# EAGLE design Mainboard (EAGLE 9.2.2)
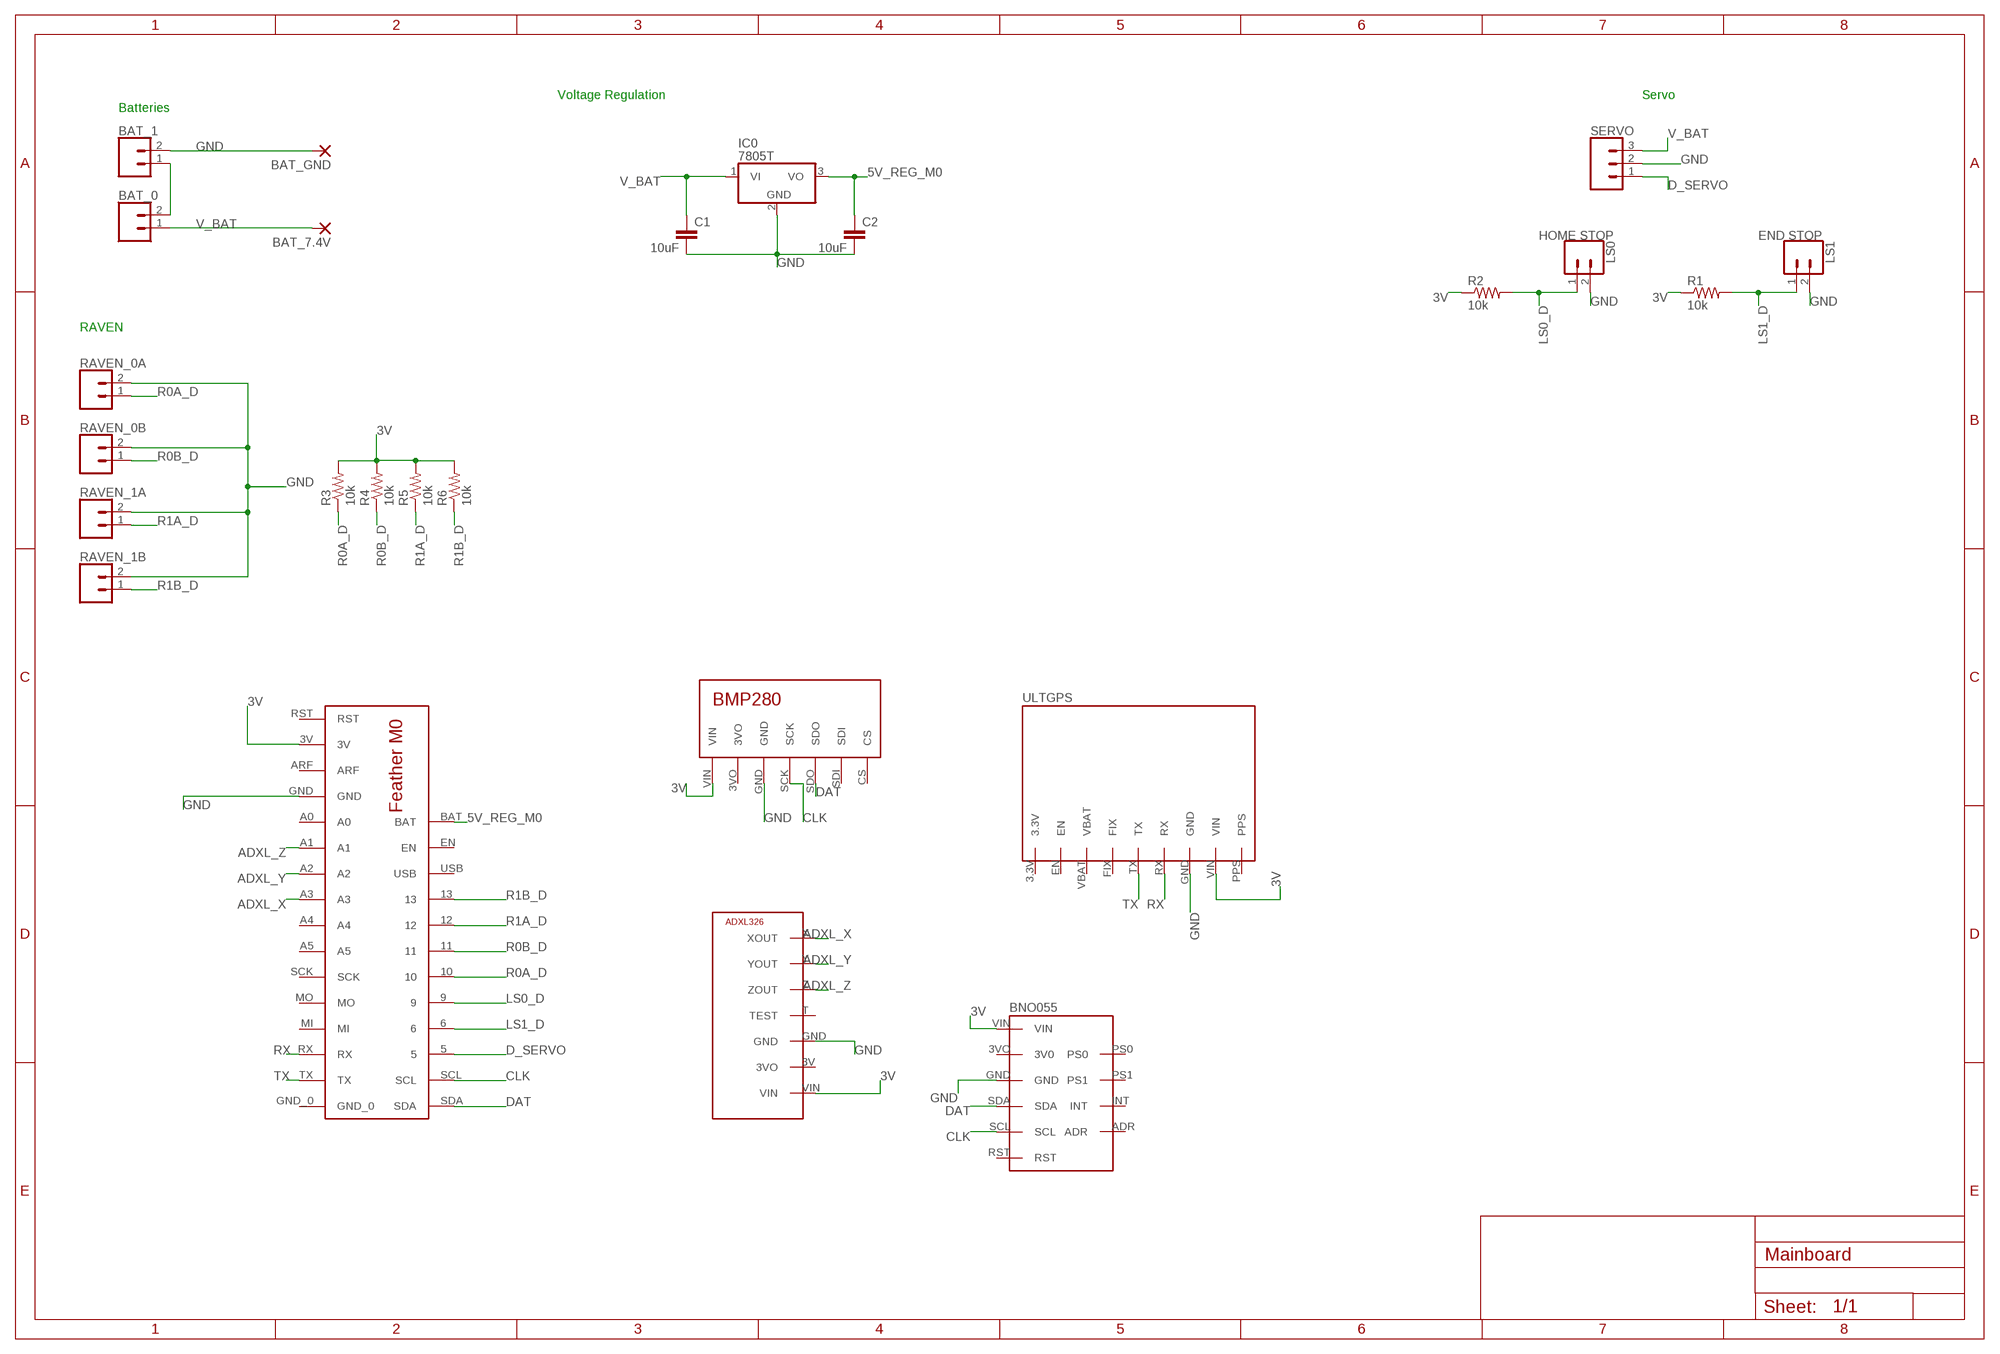
[diagram p0: schematic, sheet 1]

## Parts
BAT_0  CONN_02JST-PTH-2  [JST-2-PTH]
BAT_1  CONN_02JST-PTH-2  [JST-2-PTH]
BAT_7.4V  3,81/1,4  [3,81/1,4]
BAT_GND  3,81/1,4  [3,81/1,4]
C1  10uF  C2,5-3  [C2.5-3]
C2  10uF  C2,5-3  [C2.5-3]
IC0  7805T  [TO220H]
LS0  HOME STOP  CONN_02JST-PTH-2  [JST-2-PTH]
LS1  END STOP  CONN_02JST-PTH-2  [JST-2-PTH]
R1  10k  R-US_0207/10  [0207/10]
R2  10k  R-US_0207/10  [0207/10]
R3  10k  R-US_0207/10  [0207/10]
R4  10k  R-US_0207/10  [0207/10]
R5  10k  R-US_0207/10  [0207/10]
R6  10k  R-US_0207/10  [0207/10]
RAVEN_0A  CONN_02JST-PTH-2  [JST-2-PTH]
RAVEN_0B  CONN_02JST-PTH-2  [JST-2-PTH]
RAVEN_1A  CONN_02JST-PTH-2  [JST-2-PTH]
RAVEN_1B  CONN_02JST-PTH-2  [JST-2-PTH]
SERVO  CONN_03JST-PTH  [JST-3-PTH]
U$1  M0  [M0]
U$2  BMP  [BMP]
U$3  ADXL377  [ADXL377]
U$4  ULTGPS  [ULTGPS]
U$5  BNO055  [BNO055]

## Nets
3V: R1.1 R2.1 R3.2 R4.2 R5.2 R6.2 U$1.3V U$2.VIN U$3.VIN U$4.VIN U$5.VIN
5V_REG_M0: C2.1 IC0.3(VO) U$1.BAT
ADXL_X: U$1.A3 U$3.X(XOUT)
ADXL_Y: U$1.A2 U$3.Y(YOUT)
ADXL_Z: U$1.A1 U$3.Z(ZOUT)
B_INT: BAT_0.2 BAT_1.1
CLK: U$1.SCL U$2.SCK U$5.SCL
D_SERVO: SERVO.1 U$1.5
DAT: U$1.SDA U$2.SDO U$5.SDA
GND: BAT_1.2 BAT_GND.1(P) C1.2 C2.2 IC0.2(GND) LS0.2 LS1.2 RAVEN_0A.2 RAVEN_0B.2 RAVEN_1A.2 RAVEN_1B.2 SERVO.2 U$1.GND U$2.GND U$3.GND U$4.GND U$5.GND
LS0_D: LS0.1 R2.2 U$1.9
LS1_D: LS1.1 R1.2 U$1.6
R0A_D: R3.1 RAVEN_0A.1 U$1.10
R0B_D: R4.1 RAVEN_0B.1 U$1.11
R1A_D: R5.1 RAVEN_1A.1 U$1.12
R1B_D: R6.1 RAVEN_1B.1 U$1.13
RX: U$1.RX U$4.RX
TX: U$1.TX U$4.TX
V_BAT: BAT_0.1 BAT_7.4V.1(P) C1.1 IC0.1(VI) SERVO.3
Unconnected: U$1.A0 U$1.A4 U$1.A5 U$1.ARF U$1.EN U$1.GND_0 U$1.MI U$1.MO U$1.RST U$1.SCK U$1.USB U$2.3VO U$2.CS U$2.SDI U$3.3V(3VO) U$3.T(TEST) U$4.3.3V U$4.EN U$4.FIX U$4.PPS U$4.VBAT U$5.3VO(3V0) U$5.ADR U$5.INT U$5.PS0 U$5.PS1 U$5.RST

## Notes on the sheet
- Voltage Regulation | Servo
- Batteries
- RAVEN

## Library data of the parts
BAT_0 BAT_1 LS0 LS1 RAVEN_0A RAVEN_0B RAVEN_1A RAVEN_1B = SparkFun-Connectors:CONN_02: Multi connection point. Often used as Generic Header-pin footprint for 0.1 inch spaced/style header connections On any of the 0.1 inch spaced packages, you can populate with these: Break Away Headers - Straight <https://www.sparkfun.com/products/116> (PRT-00116) Break Away Male Headers - Right Angle <https://www.sparkfun.com/products/553> (PRT-00553) Female Headers <https://www.sparkfun.com/products/115> (PRT-00115) Break Away Headers - Machine Pin <https://www.sparkfun.com/products/117> (PRT-00117) Break Away Female Headers - Swiss Machine Pin <https://www.sparkfun.com/products/743> (PRT-00743) For SCREWTERMINALS and SPRING TERMINALS visit here: Screw Terimnals on SparkFun.com <https://www.sparkfun.com/search/results?term=Screw+Terminals> (5mm/3.5mm/2.54mm spacing) This device is also useful as a general connection point to wire up your design to another part of your project. Our various solder wires solder well into these plated through hole pads. Hook-Up Wire - Assortment (Stranded, 22 AWG) <https://www.sparkfun.com/products/11375> (PRT-11375) Hook-Up Wire - Assortment (Solid Core, 22 AWG) <https://www.sparkfun.com/products/11367> (PRT-11367) View the entire wire category on our website here <https://www.sparkfun.com/categories/141> Special notes: Molex polarized connector foot print use with: PRT-08233 with associated crimp pins and housings. 2.54_SCREWTERM for use with PRT-10571. 3.5mm Screw Terminal footprints for PRT-08084 5mm Screw Terminal footprints for use with PRT-08432; PROD_ID: CONN-09863; SKU: PRT-09914
BAT_7.4V BAT_GND = wirepad:3,81/1,4: THROUGH-HOLE PAD
C1 C2 = capacitor-wima:C: CAPACITOR naming: grid - package width
IC0 = linear:78*: Positive VOLTAGE REGULATOR Source: http://cache.national.com/ds/LM/LM78L05.pdf http://www.fairchildsemi.com/ds/LM/LM7805.pdf
R1-R6 = rcl:R-US_: RESISTOR, American symbol; SPICEPREFIX: R
SERVO = SparkFun-Connectors:CONN_03: Multi connection point. Often used as Generic Header-pin footprint for 0.1 inch spaced/style header connections On any of the 0.1 inch spaced packages, you can populate with these: Break Away Headers - Straight <https://www.sparkfun.com/products/116> (PRT-00116) Break Away Male Headers - Right Angle <https://www.sparkfun.com/products/553> (PRT-00553) Female Headers <https://www.sparkfun.com/products/115> (PRT-00115) Break Away Headers - Machine Pin <https://www.sparkfun.com/products/117> (PRT-00117) Break Away Female Headers - Swiss Machine Pin <https://www.sparkfun.com/products/743> (PRT-00743) Stackable Header - 3 Pin (Female, 0.1") <https://www.sparkfun.com/products/13875> (PRT-13875) For SCREWTERMINALS and SPRING TERMINALS visit here: Screw Terimnals on SparkFun.com <https://www.sparkfun.com/search/results?term=Screw+Terminals> (5mm/3.5mm/2.54mm spacing) This device is also useful as a general connection point to wire up your design to another part of your project. Our various solder wires solder well into these plated through hole pads. Hook-Up Wire - Assortment (Stranded, 22 AWG) <https://www.sparkfun.com/products/11375> (PRT-11375) Hook-Up Wire - Assortment (Solid Core, 22 AWG) <https://www.sparkfun.com/products/11367> (PRT-11367) View the entire wire category on our website here <https://www.sparkfun.com/categories/141> Special notes: Molex polarized connector foot print use with SKU : PRT-08232 with associated crimp pins and housings.; PROD_ID: WIRE-10037; SF_ID: PRT-09915
U$1 = M0:M0
U$2 = M0:BMP
U$3 = M0:ADXL377
U$4 = ULTGPS:ULTGPS
U$5 = BNO055:BNO055

## Board
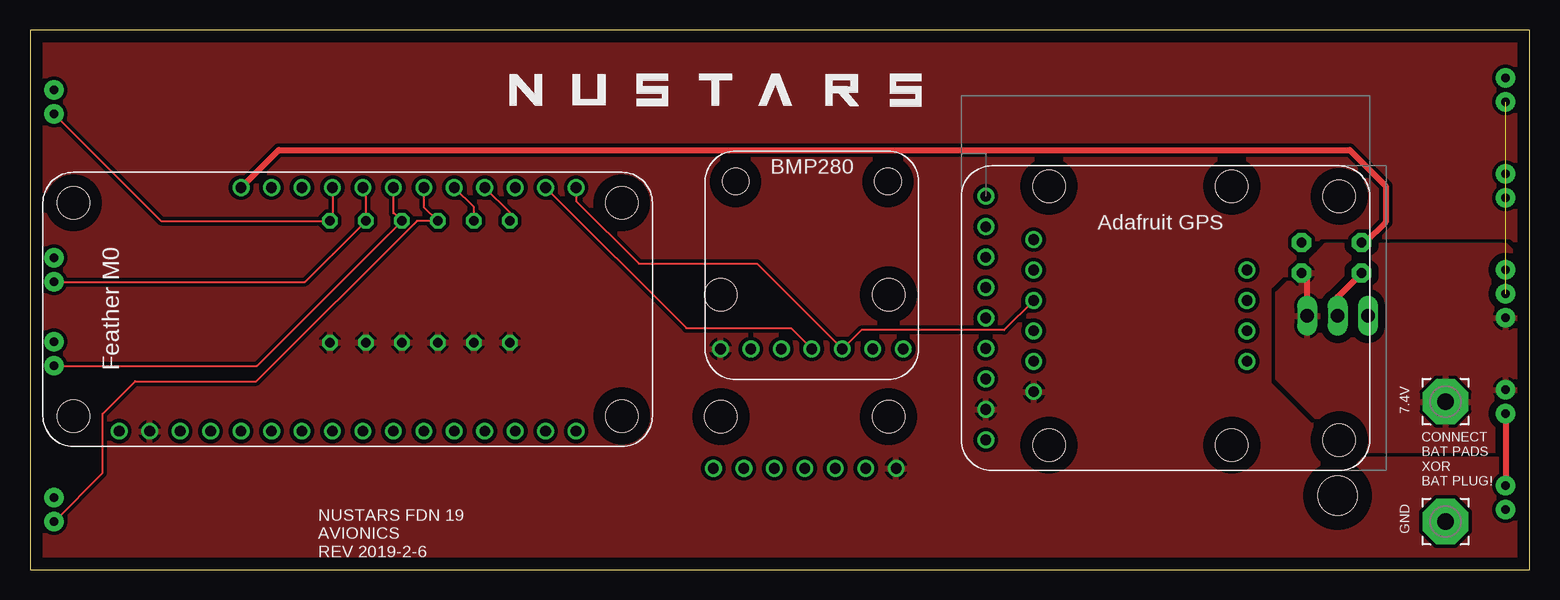
[diagram p1: board, top side]
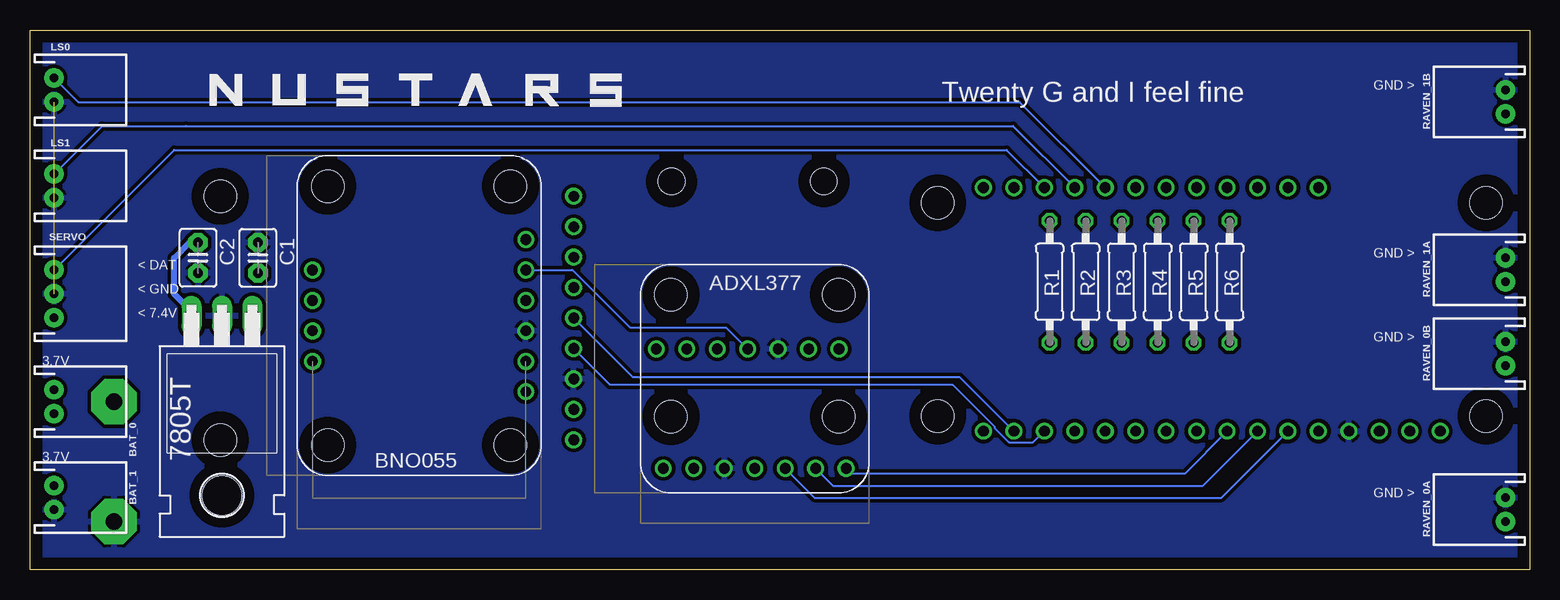
[diagram p2: board, bottom side, seen from below]

Size 125 x 45 mm. Coordinates in mm from the lower left corner, seen from the top.
Outline: 0,0 125,0 125,45 0,45 0,0
Copper layers (1*16): Top 0.035mm / dielectric 1.5mm / Bottom 0.035mm
Design rules "default": minimum track width 6mil, minimum drill 0.35mm, track to track 6mil, track to pad 6mil, pad to pad 6mil, via to via 6mil, smd to smd 6mil, copper to edge 40mil, drill to drill 6mil, minimum pad ring 10mil, minimum via ring 8mil, stop-mask expansion 4mil, vias tented up to drill 0mil, thermal gap 10mil

### Footprints (pad centres in the part's own frame; a part is rotated, then mirrored left to right if it is on the bottom)
JST-2-PTH = drill 0.7 pad 1.6: 1 -1,0; 2 1,0
3,81/1,4 = drill 1.397 pad 3.81 octagon: 1 0,0
C2.5-3 = drill 0.813 pad 1.6 octagon: 1 -1.27,0; 2 1.27,0
TO220H = drill 1.118 long: 1 -2.54,-10.16; 2 0,-10.16; 3 2.54,-10.16 | hole 3.302: 0,4.826
0207/10 = drill 0.813 octagon: 1 -5.08,0; 2 5.08,0
JST-3-PTH = drill 0.7 pad 1.6: 1 -2,0; 2 0,0; 3 2,0
M0 = drill 0.9: 3V -6.35,-10.16; 5 24.13,10.16; 6 21.59,10.16; 9 19.05,10.16; 10 16.51,10.16; 11 13.97,10.16; 12 11.43,10.16; 13 8.89,10.16; A0 1.27,-10.16; A1 3.81,-10.16; A2 6.35,-10.16; A3 8.89,-10.16; A4 11.43,-10.16; A5 13.97,-10.16; ARF -3.81,-10.16; BAT 1.27,10.16; EN 3.81,10.16; GND -1.27,-10.16; GND_0 29.21,-10.16; MI 19.05,-10.16; MO 21.59,-10.16; RST -8.89,-10.16; RX 24.13,-10.16; SCK 16.51,-10.16; SCL 26.67,10.16; SDA 29.21,10.16; TX 26.67,-10.16; USB 6.35,10.16 | hole 2.692: 33.02,8.89; -12.7,8.89; -12.7,-8.89; 33.02,-8.89
BMP = drill 0.9: 3VO 3.81,2.54; CS 16.51,2.54; GND 6.35,2.54; SCK 8.89,2.54; SDI 13.97,2.54; SDO 11.43,2.54; VIN 1.27,2.54 | hole 2.2: 2.54,16.51; 15.24,16.51
ADXL377 = drill 0.9: 3V 4.445,2.032; GND 6.985,2.032; T 9.525,2.032; VIN 1.905,2.032; X 17.145,2.032; Y 14.605,2.032; Z 12.065,2.032 | hole 2.692: 16.51,6.35; 2.54,16.51; 16.51,16.51; 2.54,6.35
ULTGPS = drill 0.9: 3.3V -10.16,-14.986; EN -7.62,-14.986; FIX -2.54,-14.986; GND 5.08,-14.986; PPS 10.16,-14.986; RX 2.54,-14.986; TX 0,-14.986; VBAT -5.08,-14.986; VIN 7.62,-14.986 | hole 2.692: 10.16,14.478; -10.16,14.478
BNO055 = drill 0.9: 3VO -3.81,-8.89; ADR 3.81,8.89; GND -1.27,-8.89; INT 1.27,8.89; PS0 -3.81,8.89; PS1 -1.27,8.89; RST 6.35,-8.89; SCL 3.81,-8.89; SDA 1.27,-8.89; VIN -6.35,-8.89 | hole 2.692: -10.795,7.62; -10.795,-7.62; 10.795,-7.62; 10.795,7.62

### Placement (x,y rotation side)
BAT_0  123,14 270 bottom
BAT_1  123,6 270 bottom
BAT_7.4V  118,14 0 top
BAT_GND  118,4 0 top
C1  106,26 90 bottom
C2  111,26 270 bottom
IC0  109,11 180 bottom
LS0  123,40 270 bottom
LS1  123,32 270 bottom
R1  40,24 90 bottom
R2  37,24 90 bottom
R3  34,24 270 bottom
R4  31,24 270 bottom
R5  28,24 270 bottom
R6  25,24 270 bottom
RAVEN_0A  2,5 90 bottom
RAVEN_0B  2,18 90 bottom
RAVEN_1A  2,25 90 bottom
RAVEN_1B  2,39 90 bottom
SERVO  123,23 270 bottom
U$1  16.32,21.7 0 top
U$2  56.28,15.85 0 top
U$3  74.11,6.4 0 bottom
U$4  94.66,20.97 270 top
U$5  92.56,21.18 90 bottom

### Tracks (layer width: path | path; a pad name or v marks a point on that pad's centre or on a via)
3V
  pour Top (isolate 0.305, rank 2): -2,47 127,47 127,-2 -2,-2
5V_REG_M0
  Top 0.508: U$1.BAT 20.73,35 110,35 113,32 113,29 111.27,27.27 C2.1
  Bottom 0.508: IC0.3 111.54,21.54 113,23 113,26 111.73,27.27 C2.1
ADXL_X
  Bottom 0.152: U$1.A3 28.75,8 56.53,8 U$3.X
ADXL_Y
  Bottom 0.152: U$3.Y 58.07,7 27.21,7 U$1.A2
ADXL_Z
  Bottom 0.152: U$3.Z 59.61,6 25.67,6 U$1.A1
B_INT
  Top 0.508: BAT_0.2 BAT_1.1
CLK
  Top 0.152: U$1.SCL 54.72,20.13 63.43,20.13 U$2.SCK
  Bottom 0.152: U$5.SCL 79.77,24.99 74.97,20.18 66.96,20.18 U$2.SCK
D_SERVO
  Bottom 0.152: SERVO.1 113,35 43.59,35 U$1.5
DAT
  Top 0.152: U$1.SDA 45.53,30.74 50.76,25.51 60.59,25.51 U$2.SDO 69.3,19.98 81.2,19.98 U$5.SDA
GND  (2 unrouted)
  Top 0.508: C2.2 109,22.73 IC0.2
  pour Bottom (isolate 0.305): -1,46 126,46 126,-1 -1,-1
LS0_D
  Top 0.152: R2.2 37,30.23 U$1.9
  Bottom 0.152: LS0.1 121,39 42.51,39 U$1.9
LS1_D
  Top 0.152: R1.2 40,29.77 U$1.6
  Bottom 0.152: U$1.6 43.05,37 112,37 119,37 LS1.1
R0A_D
  Top 0.152: RAVEN_0A.1 6.06,8.06 6.06,13 8.75,15.7 18.87,15.7 32.26,29.08 R3.1 32.83,30.25 U$1.10
R0B_D
  Top 0.152: RAVEN_0B.1 18.92,17 R4.1 30.37,29.71 30.29,29.71 U$1.11
R1A_D
  Top 0.152: U$1.12 27.96,31.65 27.96,29.12 R5.1 22.92,24 RAVEN_1A.1
R1B_D
  Top 0.152: RAVEN_1B.1 10.92,29.08 R6.1 25.21,29.29 U$1.13
RX
  Bottom 0.152: U$4.RX 76.67,15.42 48.09,15.42 44.6,11.93 44.6,11.83 43.38,10.61 41.38,10.61 U$1.RX
TX
  Bottom 0.152: U$4.TX 74.76,16.05 47.5,16.05 U$1.TX
V_BAT
  Top 0.508: C1.1 106.46,24.27 IC0.1 106.46,21.1
  pour Top (isolate 0.61): 104,23 104,16 110,10 125,10 125,25 123,27 108,27

### Text on the board
tPlace: 7.4V | CONNECT / BAT PADS / XOR / BAT PLUG! | GND | NUSTARS FDN 19 / AVIONICS / REV 2019-2-6
bPlace: GND > | Twenty G and I feel fine | GND > | < DAT | < GND | < 7.4V | GND > | 3.7V | 3.7V | GND >